# Altium project Demo_PCB.PrjPcb
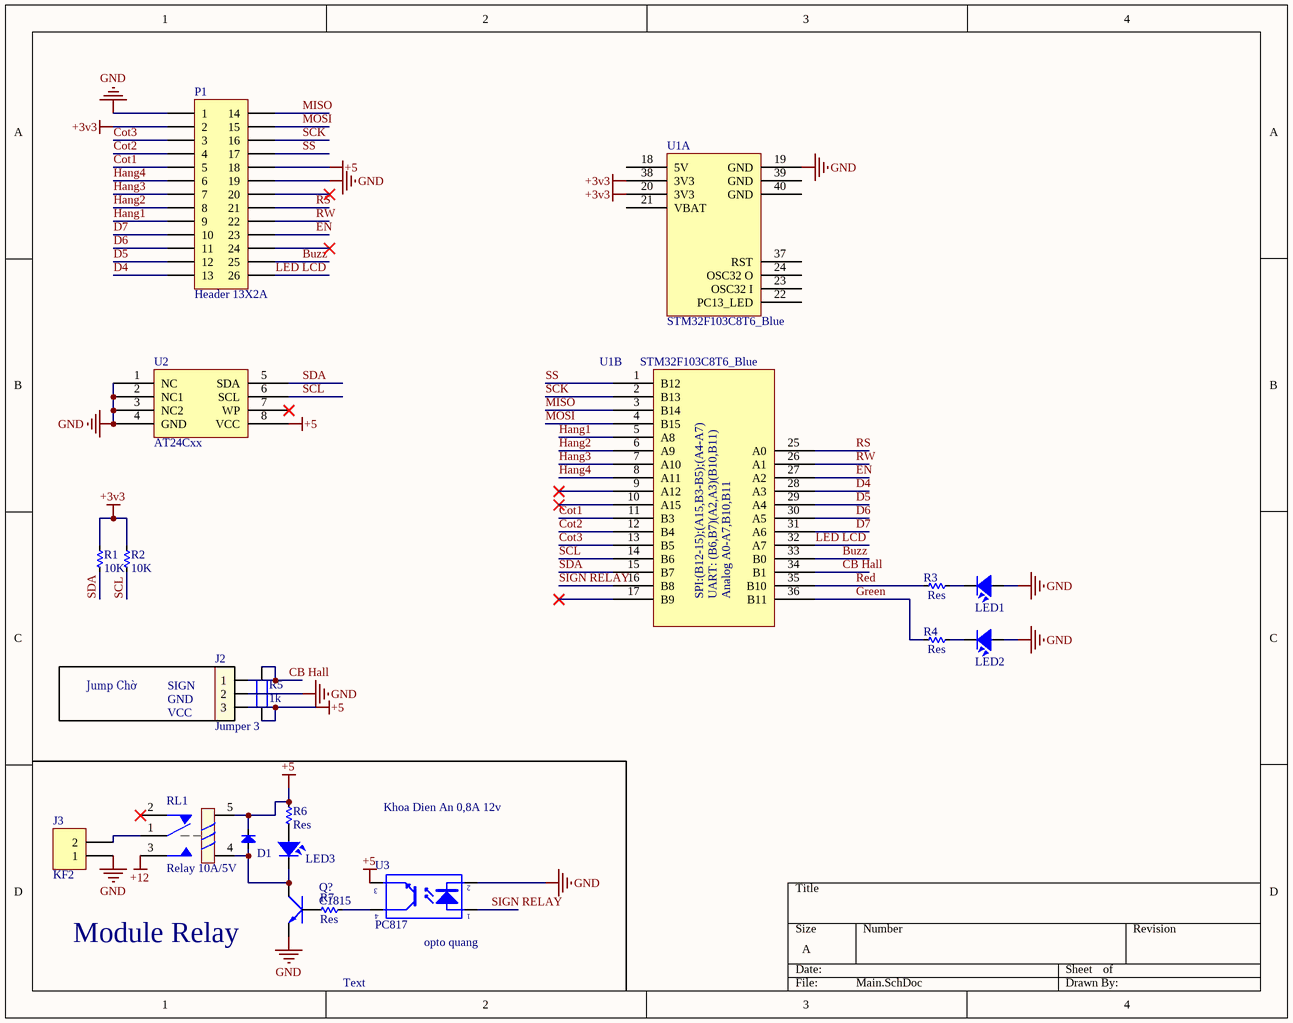
[diagram p0: Main.SchDoc]
3 sheets, 37 parts. Net scope: global (net labels, ports and power ports of the same name join across sheets).
Board file: PCB1.PcbDoc
Sheets:
  Main.SchDoc
  Power.SchDoc
  mAIN 2.SchDoc

## Sheet Main.SchDoc
size A; SheetNumber: 1; SheetTotal: 3

### Parts
D1  Diode  [DIO-0.5A-SMALL]  (value not drawn)
J2  Jumper 3  [JP3]
J3  KF2  [KF2-3.5]
LED1  LED  [LED-3MM-BLUE]  (value not drawn)
LED2  LED  [LED-3MM-BLUE]  (value not drawn)
LED3  LED  [LED-3MM-YELLOW]  (value not drawn)
P1  Header 13X2A  [HDR2X13_CEN]
Q?  C1815  [QTO-92]
R1  10K  [RES-SMD-0805]
R2  10K  [RES-SMD-0805]
R3  Res  [RES-SMD-0805]
R4  Res  [RES-SMD-0805]
R5  1k  [R1/4W]
R6  Res  [RES-SMD-0805]
R7  Res  [RES-SMD-0805]
RL1  Relay 10A/5V  [RL_SPDT_10A]
U1  STM32F103C8T6_Blue  [STM32F103 Blue Pill]  (parts A,B of 2)
U2  AT24Cxx  [SOP8smd]
U3  PC817  [DIP4/W0.3]

### Nets
+3v3: P1.2 R1.2 R2.2 U1.20(3V3) U1.38(3V3)
+5: D1.2(K) J2.3 P1.18 R5.1 R6.1 RL1.5 U2.8(VCC) U3.3(E)
+12: RL1.3
GND: J2.2 J3.1 LED1.1 LED2.1 P1.1 P1.19 Q?.1(E) U1.19(GND) U2.1(NC) U2.2(NC1) U2.3(NC2) U2.4(GND) U3.2(K)
Buzz: P1.25 U1.33(B0)
CB Hall: J2.1 R5.2 U1.34(B1)
Cot1: P1.5 U1.11(B3)
Cot2: P1.4 U1.12(B4)
Cot3: P1.3 U1.13(B5)
D4: P1.13 U1.28(A3)
D5: P1.12 U1.29(A4)
D6: P1.11 U1.30(A5)
D7: P1.10 U1.31(A6)
EN: P1.23 U1.27(A2)
Green: R4.2 U1.36(B11)
Hang1: P1.9 U1.5(A8)
Hang2: P1.8 U1.6(A9)
Hang3: P1.7 U1.7(A10)
Hang4: P1.6 U1.8(A11)
LED LCD: P1.26 U1.32(A7)
MISO: P1.14 U1.3(B14)
MOSI: P1.15 U1.4(B15)
Red: R3.2 U1.35(B10)
RS: P1.21 U1.25(A0)
RW: P1.22 U1.26(A1)
SCK: P1.16 U1.2(B13)
SCL: R2.1 U1.14(B6) U2.6(SCL)
SDA: R1.1 U1.15(B7) U2.5(SDA)
SIGN RELAY: U1.16(B8) U3.1(A)
SS: P1.17 U1.1(B12)
NetD1_1: D1.1(A) LED3.2 Q?.2(C) RL1.4
NetJ3_2: J3.2 RL1.1
NetLED1_2: LED1.2 R3.1
NetLED2_2: LED2.2 R4.1
NetLED3_1: LED3.1 R6.2
NetQ?_3: Q?.3(B) R7.2
NetR7_1: R7.1 U3.4(C)

Not connected (* = marked no-connect by the designer): P1 20* 24*; RL1 2*; U1 9(A12)* 10(A15)* 17(B9)* 18(5V) 21(VBAT) 22(PC13_LED) 23(OSC32_I) 24(OSC32_O) 37(RST) 39(GND) 40(GND); U2 7(WP)*

### Notes on the sheet
- Jump Chờ
- GND
- (near J2) SIGN
- VCC
- Khoa Dien An 0,8A 12v
- Module Relay
- (near U3) opto quang
- Text
- (in symbol STM32F103C8T6_Blue, part B) SPI:(B12-15);(A15,B3-B5);(A4-A7); UART: (B6,B7)(A2,A3)(B10,B11); Analog A0-A7,B10,B11

### Library data of the parts
D1 = Diode: Default Diode; Code - JEDEC: DO-214-AB; Value: 1N5007; Published: 8-Jun-2000; Revision: July-2002: Re-released for DXP Platform.; Publisher: Altium Limited
J2 = JP3: Value: J3
J3 = KF2: Manufacturer: Würth Elektronik eiSos GmbH; partNo: 691103110002; ComponentLink1 Description: Manufacturer; ComponentLink2 Description: Datasheet; NoPins: 2; Created Date: 29 October 2013; ComponentLink1URL: http://www.we-online.com; ComponentLink2URL: http://katalog.we-online.de/em/datasheet/6911031100xx.pdf; Created by: Karrer Zheng
LED1-LED3 = LED: LED Single colour Green and Red; Value: LED 3 ly Single Colour
P1 = Header 13X2A: Header, 13-Pin, Dual row; Solder: WAVE
Q? = C1815: NPN 600mW, ECB; Value: C1815
R1-R4 R6 R7 = Res-SMD: Resistor; Manufacturer: Generic Components; Class: Passive; Published: 08/06/2000; Publisher: Altium Hobart Technology Centre
R5 = R1/4W: Resistor 1/4W; Value: R1/4W - 1K
RL1 = Relay 1: Relay SPDT,10A - 12VDC 5 Pin; Value: Relay SPDT, 10A, 12V
U1 = STM32F103C8T6_Blue: Kit STM32F103C8T6 Blue Pill
U3 = PC817: Single Opto; Value: PC817

## Sheet Power.SchDoc
size A; SheetNumber: 2; SheetTotal: 3
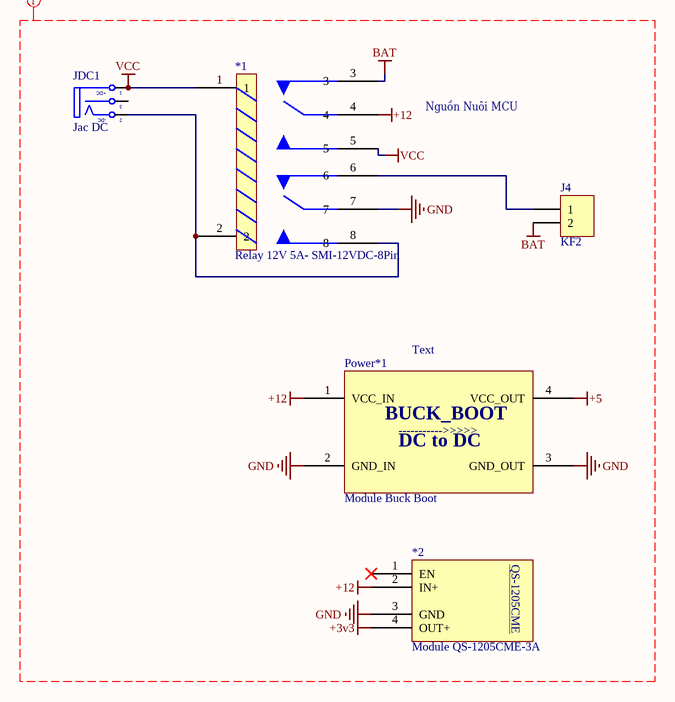
[diagram p1: Power.SchDoc]

### Parts
*1  Relay 12V 5A- SMI-12VDC-8Pin  [Relay SMI-12VDC-SL-8Pin]
*2  Module QS-1205CME-3A  [QS-1205CME-3A]
J4  KF2  [KF2-3.5]
JDC1  Jac DC  [DC-IN]
Power*1  Module Buck Boot  [Module_BUCK_BOOT]

### Nets
+3v3: *2.4(OUT+)
+5: Power*1.4(VCC_OUT)
+12: *1.4 *2.2(IN+) Power*1.1(VCC_IN)
BAT: *1.3 J4.2
GND: *1.7 *2.3(GND) Power*1.2(GND_IN) Power*1.3(GND_OUT)
VCC: *1.1 *1.5 JDC1.1(T)
Net*1_2: *1.2 *1.8 JDC1.2(TN)
Net*1_6: *1.6 J4.1

Not connected (* = marked no-connect by the designer): *2 1(EN)*; JDC1 3(S)

### Layout directives
rule Width Constraint [Pref Width = 1mm    Min Width = 0.7mm    Max Width = 1.3mm]; rule Routing Via Style [Pref Size = 2mm    Pref Hole Size = 0.711mm]: +3v3, +5, +12, BAT, GND, VCC

### Notes on the sheet
- Nguồn Nuôi MCU
- (near Power*1) Text
- (in symbol DCIN) +DC; -DC
- (in symbol Module Buck Boot) BUCK_BOOT; ----------->>>>>; DC to DC
- (in symbol Module QS-1205CME-3A) QS-1205CME

### Library data of the parts
*2 = Module QS-1205CME-3A: Mạch Hạ Áp Mini 3A Nhiều Đầu Ra QS-1205CME-3A
J4 = KF2: as J3 on sheet Main; Created Date: 29 October 2013; ComponentLink1URL: http://www.we-online.com; ComponentLink2URL: http://katalog.we-online.de/em/datasheet/6911031100xx.pdf; Created by: Karrer Zheng
JDC1 = DCIN: Jac DC input; Value: Jac DC

## Sheet mAIN 2.SchDoc
size A; SheetNumber: 3; SheetTotal: 3
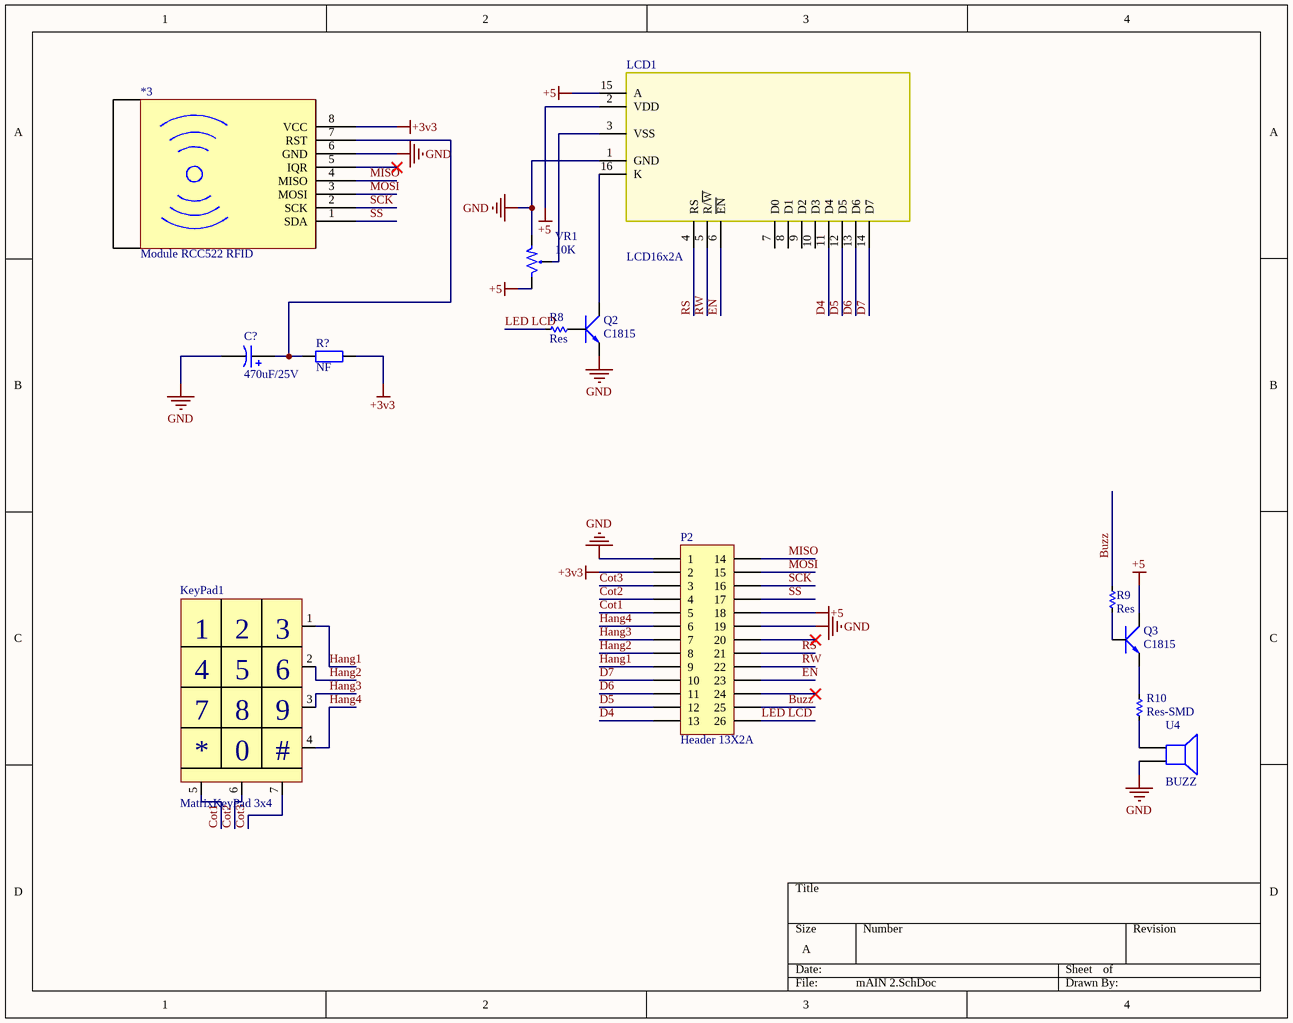
[diagram p2: mAIN 2.SchDoc]

### Parts
*3  Module RCC522 RFID  [Module RCC522 RFID]
C?  470uF/25V  [CAP_ALUM_D100_S50_H200]
KeyPad1  MatrixKeyPad 3x4  [MatrixKeyPad(3x4)]
LCD1  LCD16x2A  [LCD16X2]
P2  Header 13X2A  [HDR2X13_CEN]
Q2  C1815  [QTO-92]
Q3  C1815  [QTO-92]
R8  Res  [RES-1/4W-SMALL]
R9  Res  [RES-1/4W-SMALL]
R10  Res-SMD  [RES-SMD-0805]
R?  NF  [RESC-0603 (1608)]
U4  BUZZ  [BUZZER_through_hole]
VR1  10K  [VR]

### Nets
+3v3: *3.8(VCC) P2.2 R?.2
+5: LCD1.2(VDD) LCD1.15(A) P2.18 Q3.2(C) VR1.3
GND: *3.6(GND) C?.2 LCD1.1(GND) P2.1 P2.19 Q2.1(E) U4.2 VR1.1
Buzz: P2.25 R9.2
Cot1: KeyPad1.5 P2.5
Cot2: KeyPad1.6 P2.4
Cot3: KeyPad1.7 P2.3
D4: LCD1.11(D4) P2.13
D5: LCD1.12(D5) P2.12
D6: LCD1.13(D6) P2.11
D7: LCD1.14(D7) P2.10
EN: LCD1.6(~{EN}) P2.23
Hang1: KeyPad1.1 P2.9
Hang2: KeyPad1.2 P2.8
Hang3: KeyPad1.3 P2.7
Hang4: KeyPad1.4 P2.6
LED LCD: P2.26 R8.2
MISO: *3.4(MISO) P2.14
MOSI: *3.3(MOSI) P2.15
RS: LCD1.4(RS) P2.21
RW: LCD1.5(R/~{W}) P2.22
SCK: *3.2(SCK) P2.16
SS: *3.1(SDA) P2.17
Net*3_7: *3.7(RST) C?.1 R?.1
NetLCD1_3: LCD1.3(VSS) VR1.2
NetLCD1_16: LCD1.16(K) Q2.2(C)
NetQ2_3: Q2.3(B) R8.1
NetQ3_1: Q3.1(E) R10.1
NetQ3_3: Q3.3(B) R9.1
NetR10_2: R10.2 U4.1

Not connected (* = marked no-connect by the designer): *3 5(IQR)*; LCD1 7(D0) 8(D1) 9(D2) 10(D3); P2 20* 24*

### Notes on the sheet
- (in symbol MatrixKeyPad 3x4) 8; 9; 0; #

### Library data of the parts
C? = 25NA470MEFC10X20: CAP ALUM 470uF 20% 25V RADIAL; Solder: WAVE; CompanyID: VT-00047; MPN: 25NA470MEFC10X20; Value: 470uF/25V; Category: CAPACITOR; PinCount: 2
LCD1 = LCD16x2: LCD dipslay 16 char, 2 line; Value: LCD16x2A
P2 = Header 13X2A: Header, 13-Pin, Dual row; Solder: WAVE
Q2 Q3 = C1815: NPN 600mW, ECB; Value: C1815
R8 R9 = Res: Manufacturer: Generic Components; Class: Passive; SubClass: R; Published: 08/06/2000; Publisher: Altium Hobart Technology Centre
R10 = Res-SMD: as R1 on sheet Main; Published: 08/06/2000; Publisher: Altium Hobart Technology Centre
R? = RESC NF 0603: RES SMD, Not Fill, 0603; Solder: Not Fill; Value: NF; Category: RESISTOR
U4 = Speaker: Loudspeaker
VR1 = VR1: Var Resistor; Value: VR 10K

## Nets that join several sheets
+3v3: Main (5 pins), Power (*2.4), mAIN 2 (*3.8 P2.2 R?.2)
+5: Main (8 pins), Power (Power*1.4), mAIN 2 (5 pins)
+12: Main (RL1.3), Power (*1.4 *2.2 Power*1.1)
GND: Main (13 pins), Power (*1.7 *2.3 Power*1.2 Power*1.3), mAIN 2 (8 pins)
Buzz: Main (P1.25 U1.33), mAIN 2 (P2.25 R9.2)
Cot1: Main (P1.5 U1.11), mAIN 2 (KeyPad1.5 P2.5)
Cot2: Main (P1.4 U1.12), mAIN 2 (KeyPad1.6 P2.4)
Cot3: Main (P1.3 U1.13), mAIN 2 (KeyPad1.7 P2.3)
D4: Main (P1.13 U1.28), mAIN 2 (LCD1.11 P2.13)
D5: Main (P1.12 U1.29), mAIN 2 (LCD1.12 P2.12)
D6: Main (P1.11 U1.30), mAIN 2 (LCD1.13 P2.11)
D7: Main (P1.10 U1.31), mAIN 2 (LCD1.14 P2.10)
EN: Main (P1.23 U1.27), mAIN 2 (LCD1.6 P2.23)
Hang1: Main (P1.9 U1.5), mAIN 2 (KeyPad1.1 P2.9)
Hang2: Main (P1.8 U1.6), mAIN 2 (KeyPad1.2 P2.8)
Hang3: Main (P1.7 U1.7), mAIN 2 (KeyPad1.3 P2.7)
Hang4: Main (P1.6 U1.8), mAIN 2 (KeyPad1.4 P2.6)
LED LCD: Main (P1.26 U1.32), mAIN 2 (P2.26 R8.2)
MISO: Main (P1.14 U1.3), mAIN 2 (*3.4 P2.14)
MOSI: Main (P1.15 U1.4), mAIN 2 (*3.3 P2.15)
RS: Main (P1.21 U1.25), mAIN 2 (LCD1.4 P2.21)
RW: Main (P1.22 U1.26), mAIN 2 (LCD1.5 P2.22)
SCK: Main (P1.16 U1.2), mAIN 2 (*3.2 P2.16)
SS: Main (P1.17 U1.1), mAIN 2 (*3.1 P2.17)